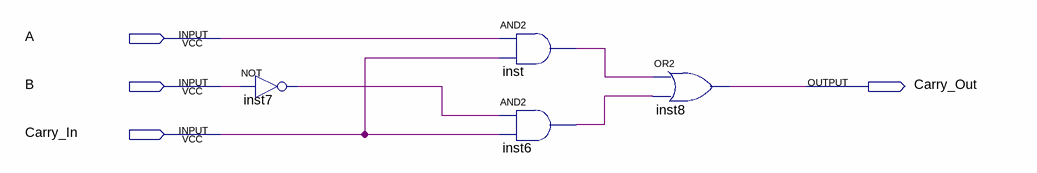
[diagram p0: schematic sheet]
// Quartus schematic MaiorQ1Bit.bdf as structural Verilog: 4 symbols, 4 pins
module MaiorQ1Bit (
  input  A,
  input  B,
  input  Carry_In,
  output Carry_Out
);

  wire inst6_out, inst7_out, inst_out;

  not inst7 (inst7_out, B);
  and inst (inst_out, A, Carry_In);
  and inst6 (inst6_out, inst7_out, Carry_In);
  or inst8 (Carry_Out, inst_out, inst6_out);
endmodule
